# EAGLE design scratchBotV2 (EAGLE 9.6.2)
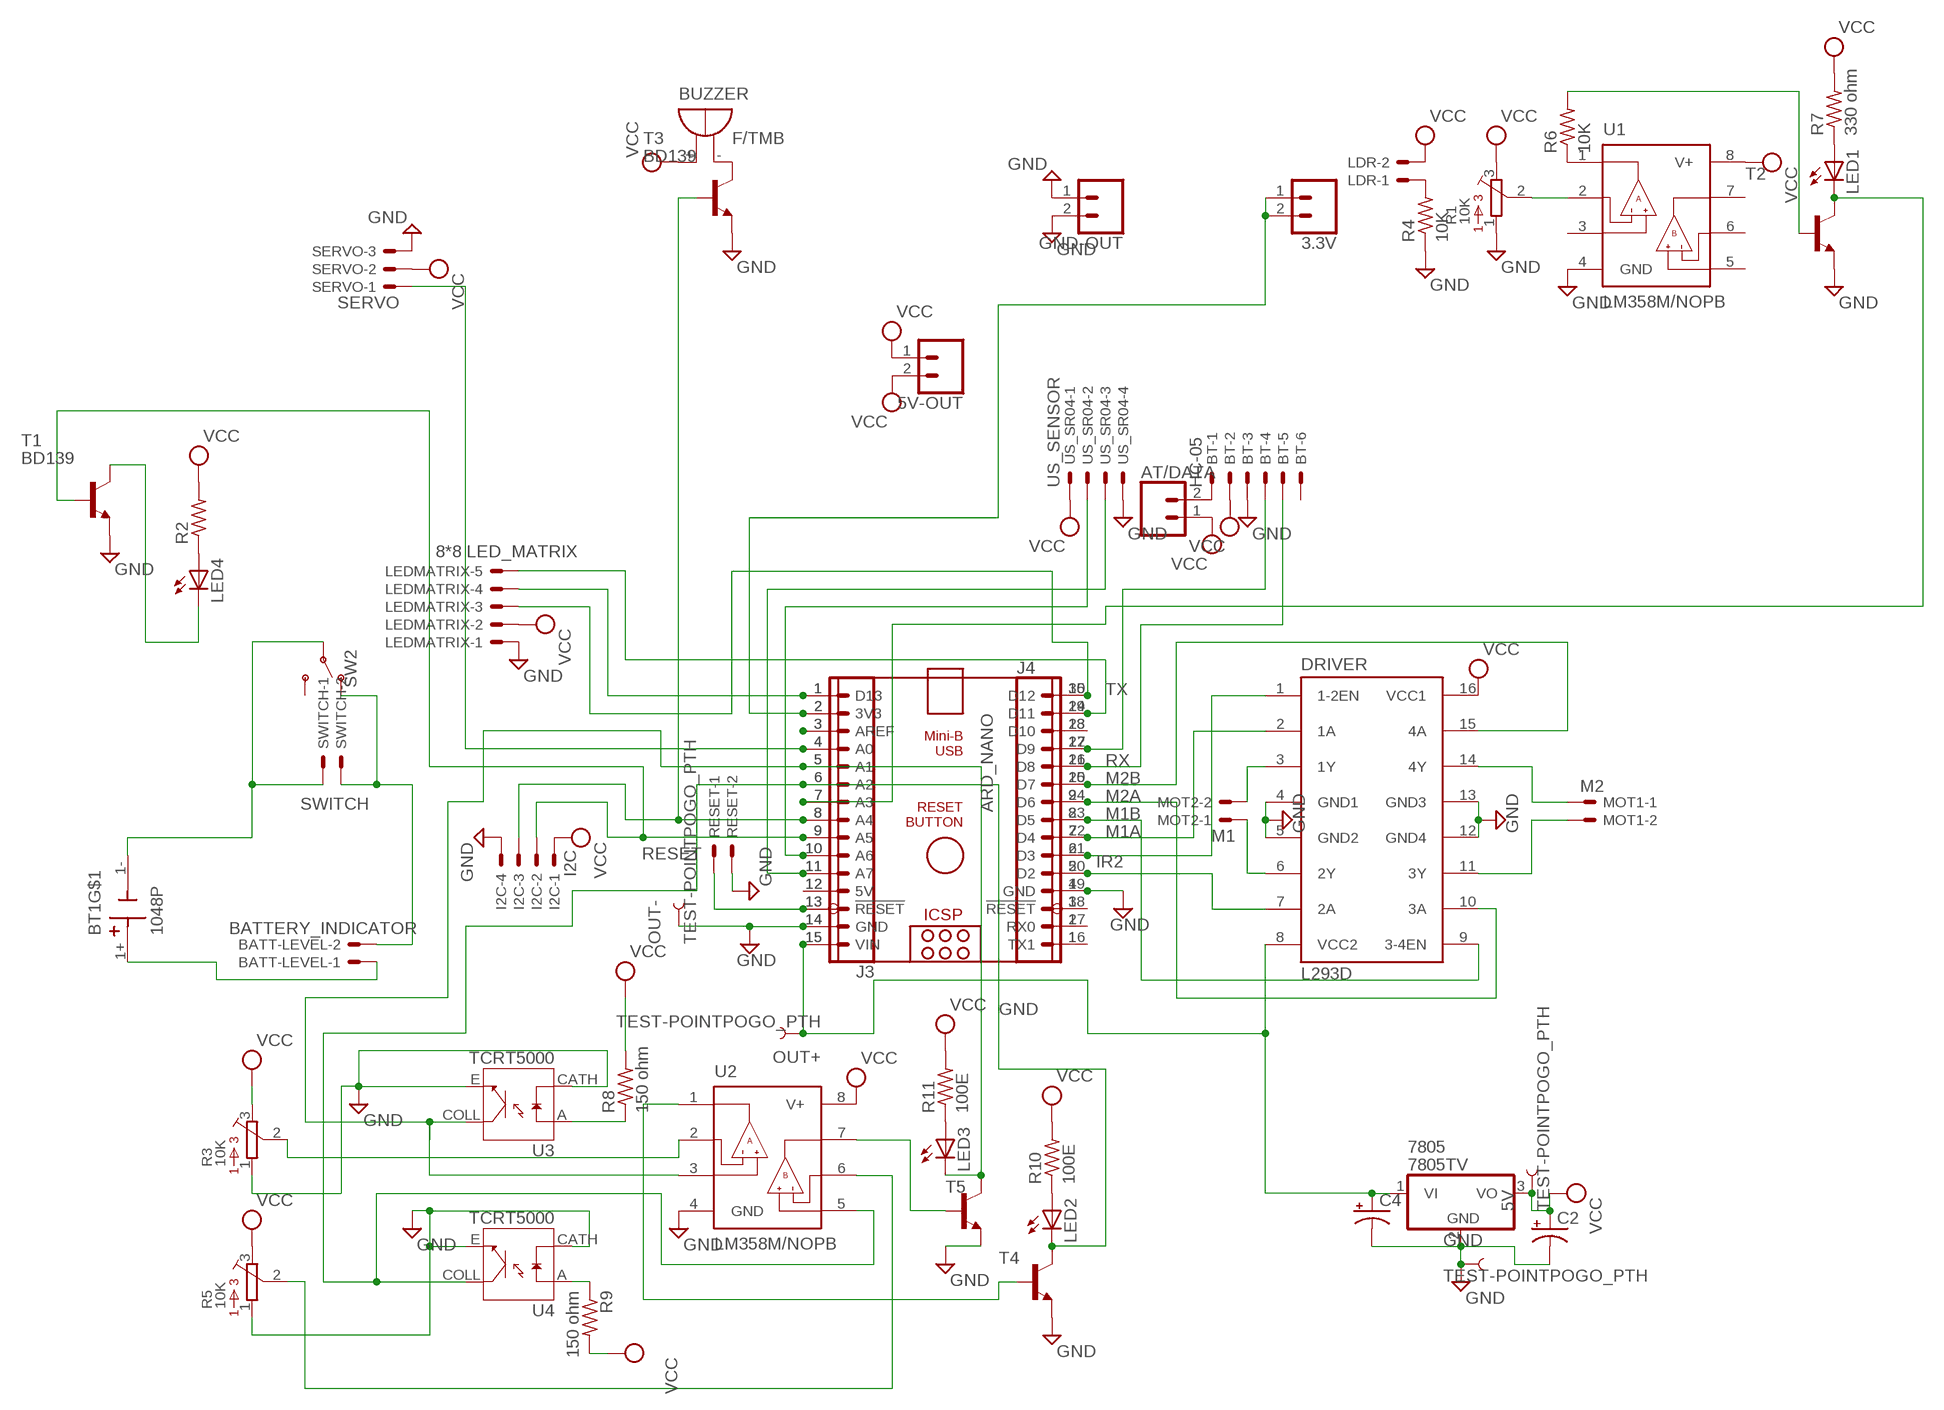
[diagram p0: schematic, sheet 1]

## Parts
3.3V  CONN_02  [1X02]
5V  TEST-POINTPOGO_PTH  [1X01_NO_SILK]
5V-OUT  CONN_02  [1X02]
7805  7805TV  [TO220V]
ARD_NANO  ARDUINO_NANO  [ARDUINO_NANO]
AT/DATA  CONN_02  [1X02]
BATT-LEVEL  BATTERY_INDICATOR  JST-XH-02-PIN-LONG-PAD  [JST-XH-02-PACKAGE-LONG-PAD]
BT  HC-05  JST-XH-06-PIN-LONG-PAD  [JST-XH-06-PACKAGE-LONG-PAD]
BT1  1048P  [BAT_1048P]
BUZZER  F/TMB  [F/TMB]
C2  CPOL-USE2.5-5  [E2,5-5]
C4  CPOL-USE2.5-5  [E2,5-5]
DRIVER  L293D  [DIL16]
GND  TEST-POINTPOGO_PTH  [1X01_NO_SILK]
GND-OUT  CONN_02  [1X02]
I2C  I2C  JST-XH-04-PIN-LONG-PAD  [JST-XH-04-PACKAGE-LONG-PAD]
J3  CONN_15  [1X15]
J4  CONN_15  [1X15]
LDR  JST-XH-02-PIN-LONG-PAD  [JST-XH-02-PACKAGE-LONG-PAD]
LED1  LEDCHIPLED_1206  [CHIPLED_1206]
LED2  LEDCHIPLED_1206  [CHIPLED_1206]
LED3  LEDCHIPLED_1206  [CHIPLED_1206]
LED4  LEDCHIPLED_1206  [CHIPLED_1206]
LEDMATRIX  8*8 LED_MATRIX  JST-XH-05-PIN-LONG-PAD  [JST-XH-05-PACKAGE-LONG-PAD]
MOT1  M2  JST-XH-02-PIN-LONG-PAD  [JST-XH-02-PACKAGE-LONG-PAD]
MOT2  M1  JST-XH-02-PIN-LONG-PAD  [JST-XH-02-PACKAGE-LONG-PAD]
OUT+  TEST-POINTPOGO_PTH  [1X01_NO_SILK]
OUT-  TEST-POINTPOGO_PTH  [1X01_NO_SILK]
R1  10K  3362H  [3362H]
R2  R-US_0204/7  [0204/7]
R3  10K  3362H  [3362H]
R4  10K  R-US_M1206  [M1206]
R5  10K  3362H  [3362H]
R6  10K  R-US_M1206  [M1206]
R7  330 ohm  R-US_M1206  [M1206]
R8  150 ohm  R-US_M1206  [M1206]
R9  150 ohm  R-US_M1206  [M1206]
R10  100E  R-US_M1206  [M1206]
R11  100E  R-US_M1206  [M1206]
RESET  RESET  JST-XH-02-PIN-LONG-PAD  [JST-XH-02-PACKAGE-LONG-PAD]
SERVO  SERVO  JST-XH-03-PIN-LONG-PAD  [JST-XH-03-PACKAGE-LONG-PAD]
SW2  SWITCH-SPDT-PTH-11.6X4.0MM  [SWITCH_SPDT_PTH_11.6X4.0MM]
SWITCH  SWITCH  JST-XH-02-PIN-LONG-PAD  [JST-XH-02-PACKAGE-LONG-PAD]
T1  BD139  [TO126]
T2  -NPN-SOT23-EBC  [SOT23-EBC]
T3  BD139  [TO126]
T4  -NPN-SOT23-EBC  [SOT23-EBC]
T5  -NPN-SOT23-EBC  [SOT23-EBC]
U1  LM358M/NOPB  [SOIC127P599X175-8N]
U2  LM358M/NOPB  [SOIC127P599X175-8N]
U3  TCRT5000  [OPTO_TCRT5000]
U4  TCRT5000  [OPTO_TCRT5000]
US_SR04  US_SENSOR  JST-XH-04-PIN-LONG-PAD  [JST-XH-04-PACKAGE-LONG-PAD]

## Nets
9V-MT3608: 7805.1(VI) ARD_NANO.15(VIN) C4.+ DRIVER.8(VCC2) J3.15 OUT+.1
ECHO: ARD_NANO.8(A4) I2C.3 J3.8 T3.3(B)
GND: 7805.2(GND) ARD_NANO.14(GND) ARD_NANO.19(GND) BT.3 C2.- C4.- DRIVER.4(GND1) DRIVER.5(GND2) DRIVER.12(GND4) DRIVER.13(GND3) GND-OUT.1 GND-OUT.2 GND.1 I2C.4 J3.14 J4.4 LEDMATRIX.1 OUT-.1 R1.1 R3.1 R4.1 R5.1 RESET.2 SERVO.3 T1.1(E) T2.E T3.1(E) T4.E T5.E U1.4(GND) U2.4(GND) U3.CATH U3.E U4.CATH U4.E US_SR04.4
IR2: ARD_NANO.21(D3) DRIVER.1(1-2EN) J4.6
M1A: ARD_NANO.22(D4) DRIVER.2(1A) J4.7
M1B: ARD_NANO.23(D5) DRIVER.9(3-4EN) J4.8
M2A: ARD_NANO.24(D6) DRIVER.10(3A) J4.9
M2B: ARD_NANO.25(D7) DRIVER.15(4A) J4.10
N$1: BT1.1- SW2.2(P) SWITCH.1
N$2: DRIVER.3(1Y) MOT2.2
N$3: R1.2 U1.2(-INA)
N$4: DRIVER.6(2Y) MOT2.1
N$5: ARD_NANO.4(A0) J3.4 SERVO.1
N$6: BATT-LEVEL.1 BT1.1+
N$8: ARD_NANO.10(A6) J3.10 US_SR04.2
N$9: DRIVER.14(4Y) MOT1.1
N$10: ARD_NANO.28(D10) J4.13
N$11: DRIVER.11(3Y) MOT1.2
N$13: ARD_NANO.27(D9) BT.4 J4.12
N$14: ARD_NANO.1(D13) J3.1 LEDMATRIX.4
N$15: ARD_NANO.7(A3) J3.7 LED1.C T2.C
N$16: ARD_NANO.5(A1) J3.5 LED3.C T5.C U2.3(+INA) U3.COLL
N$17: LED4.C T1.2(C)
N$18: BATT-LEVEL.2 SW2.1(O) SWITCH.2
N$19: ARD_NANO.13(!RESET) J3.13 RESET.1
N$20: 3.3V.1 3.3V.2 ARD_NANO.2(3V3) J3.2
N$21: ARD_NANO.11(A7) J3.11 US_SR04.3
N$22: ARD_NANO.3(AREF) J3.3
N$23: ARD_NANO.9(A5) I2C.2 J3.9 T1.3(B)
N$24: R8.1 U3.A
N$25: ARD_NANO.12(5V) J3.12
N$26: LDR.1 R4.2
N$27: R6.1 U1.1(OUTA)
N$28: R9.1 U4.A
N$29: BUZZER.- T3.2(C)
N$31: R6.2 T2.B
N$32: ARD_NANO.6(A2) J3.6 LED2.C T4.C U2.5(+INB) U4.COLL
N$33: ARD_NANO.29(D11) J4.14 LEDMATRIX.5
N$34: ARD_NANO.16(TX1) J4.1
N$35: ARD_NANO.17(RX0) J4.2
N$36: ARD_NANO.18(!RESET) J4.3
N$37: AT/DATA.2 BT.1
N$38: LED1.A R7.1
N$39: ARD_NANO.20(D2) DRIVER.7(2A) J4.5
N$42: R3.2 U2.2(-INA)
N$43: LED3.A R11.1
N$44: LED2.A R10.1
N$45: T4.B U2.1(OUTA)
N$47: T5.B U2.7(OUTB)
N$48: R5.2 U2.6(-INB)
N$49: LED4.A R2.1
RX: ARD_NANO.26(D8) BT.5 J4.11
TX: ARD_NANO.30(D12) J4.15 LEDMATRIX.3
VCC: 5V-OUT.1 5V-OUT.2 5V.1 7805.3(VO) AT/DATA.1 BT.2 BUZZER.+ C2.+ DRIVER.16(VCC1) I2C.1 LDR.2 LEDMATRIX.2 R1.3 R2.2 R3.3 R5.3 R7.2 R8.2 R9.2 R10.2 R11.2 SERVO.2 U1.8(V+) U2.8(V+) US_SR04.1
Unconnected: BT1.2+ BT1.2- BT.6 SW2.3(S) U1.3(+INA) U1.5(+INB) U1.6(-INB) U1.7(OUTB)

## Library data of the parts
3.3V 5V-OUT AT/DATA GND-OUT = SparkFun-Connectors:CONN_02: Multi connection point. Often used as Generic Header-pin footprint for 0.1 inch spaced/style header connections On any of the 0.1 inch spaced packages, you can populate with these: Break Away Headers - Straight <https://www.sparkfun.com/products/116> (PRT-00116) Break Away Male Headers - Right Angle <https://www.sparkfun.com/products/553> (PRT-00553) Female Headers <https://www.sparkfun.com/products/115> (PRT-00115) Break Away Headers - Machine Pin <https://www.sparkfun.com/products/117> (PRT-00117) Break Away Female Headers - Swiss Machine Pin <https://www.sparkfun.com/products/743> (PRT-00743) For SCREWTERMINALS and SPRING TERMINALS visit here: Screw Terimnals on SparkFun.com <https://www.sparkfun.com/search/results?term=Screw+Terminals> (5mm/3.5mm/2.54mm spacing) This device is also useful as a general connection point to wire up your design to another part of your project. Our various solder wires solder well into these plated through hole pads. Hook-Up Wire - Assortment (Stranded, 22 AWG) <https://www.sparkfun.com/products/11375> (PRT-11375) Hook-Up Wire - Assortment (Solid Core, 22 AWG) <https://www.sparkfun.com/products/11367> (PRT-11367) View the entire wire category on our website here <https://www.sparkfun.com/categories/141> Special notes: Molex polarized connector foot print use with: PRT-08233 with associated crimp pins and housings. 2.54_SCREWTERM for use with PRT-10571. 3.5mm Screw Terminal footprints for PRT-08084 5mm Screw Terminal footprints for use with PRT-08432
5V GND OUT+ OUT- = SparkFun-Connectors:TEST-POINT: SparkFun Test Points Bare copper test points for troubleshooting or In-Circuit-Testing. These are used by our Production team for verifying production board runs using pogo-pins on test beds. SparkFun Products: SparkFun LSM9DS1 Breakout <https://www.sparkfun.com/products/13284> SparkFun PSOC <https://www.sparkfun.com/products/13714> SparkFun Load Cell Amplifier <https://www.sparkfun.com/products/13879>
7805 = linear:78*: Positive VOLTAGE REGULATOR Source: http://cache.national.com/ds/LM/LM78L05.pdf http://www.fairchildsemi.com/ds/LM/LM7805.pdf
ARD_NANO = ArduinoNanoV30:ARDUINO_NANO: Arduino Nano V3.0 Overview: The Arduino Nano is a small, complete, and breadboard-friendly board based on the ATmega328 (Arduino Nano 3.x) or ATmega168 (Arduino Nano 2.x). It has more or less the same functionality of the Arduino Duemilanove, but in a different package. It lacks only a DC power jack, and works with a Mini-B USB cable instead of a standard one. The Nano was designed and is being produced by Gravitech. Specifications: Microcontroller Atmel ATmega168 or ATmega328 Operating Voltage (logic level) 5 V Input Voltage (recommended) 7-12 V Input Voltage (limits) 6-20 V Digital I/O Pins 14 (of which 6 provide PWM output) Analog Input Pins 8 DC Current per I/O Pin 40 mA Flash Memory 16 KB (ATmega168) or 32 KB (ATmega328) of which 2 KB used by bootloader SRAM 1 KB (ATmega168) or 2 KB (ATmega328) EEPROM 512 bytes (ATmega168) or 1 KB (ATmega328) Clock Speed 16 MHz Dimensions 0.73" x 1.70" Length 45 mm Width 18 mm Weigth 5 g Power: The Arduino Nano can be powered via the Mini-B USB connection, 6-20V unregulated external power supply (pin 30), or 5V regulated external power supply (pin 27). The power source is automatically selected to the highest voltage source. Memory: The ATmega168 has 16 KB of flash memory for storing code (of which 2 KB is used for the bootloader); the ATmega328 has 32 KB, (also with 2 KB used for the bootloader). The ATmega168 has 1 KB of SRAM and 512 bytes of EEPROM (which can be read and written with the EEPROM library); the ATmega328 has 2 KB of SRAM and 1 KB of EEPROM. Input and Output: Each of the 14 digital pins on the Nano can be used as an input or output, using pinMode(), digitalWrite(), and digitalRead() functions. They operate at 5 volts. Each pin can provide or receive a maximum of 40 mA and has an internal pull-up resistor (disconnected by default) of 20-50 kOhms. In addition, some pins have specialized functions. Visit Arduino - ArduinoBoardNano <https://www.arduino.cc/en/Main/ArduinoBoardNano>
BATT-LEVEL MOT1 MOT2 RESET SWITCH = Rembrandt Electronics - JST XH Connectors v1-0 (1):JST-XH-02-PIN: JST XH Connector 2 Pin Wire to board connector. Pitch: 2,54 mm, (0.100") Number of pins: 2 Created by Rembrandt Electronics www.rembrandtelectronics.com
BT = Rembrandt Electronics - JST XH Connectors v1-0 (1):JST-XH-06-PIN: JST XH Connector 2 Pin Wire to board connector. Pitch: 2,54 mm, (0.100") Number of pins: 6 Created by Rembrandt Electronics www.rembrandtelectronics.com
BT1 = 1048P:1048P: Battery Holder (Open) 18650 2 Cell SMD (SMT) Tab Check prices <https://pricing.snapeda.com/parts/1048P/Keystone%20Electronics/view-part?ref=eda>; AVAILABILITY: In Stock; DESCRIPTION: SMT Polarized Holder for Dual 18650 Batteries; MF: Keystone Electronics; MP: 1048P; PACKAGE: None; PRICE: None; PURCHASE-URL: https://pricing.snapeda.com/search/part/1048P/?ref=eda
BUZZER = buzzer:F/TMB: BUZZER Source: Buerklin; OC_FARNELL: unknown; OC_NEWARK: unknown
C2 C4 = adafruit:CPOL-US: POLARIZED CAPACITOR, American symbol
DRIVER = st-microelectronics:L293D: PUSH-PULL 4 CHANNEL DRIVER; MPN: L293D; OC_FARNELL: 9589619; OC_NEWARK: 56P8249
I2C US_SR04 = Rembrandt Electronics - JST XH Connectors v1-0 (1):JST-XH-04-PIN: JST XH Connector 2 Pin Wire to board connector. Pitch: 2,54 mm, (0.100") Number of pins: 4 Created by Rembrandt Electronics www.rembrandtelectronics.com
J3 J4 = SparkFun-Connectors:CONN_15: Multi connection point. Often used as Generic Header-pin footprint for 0.1 inch spaced/style header connections On any of the 0.1 inch spaced packages, you can populate with these: Break Away Headers - Straight <https://www.sparkfun.com/products/116> (PRT-00116) Break Away Male Headers - Right Angle <https://www.sparkfun.com/products/553> (PRT-00553) Female Headers <https://www.sparkfun.com/products/115> (PRT-00115) Break Away Headers - Machine Pin <https://www.sparkfun.com/products/117> (PRT-00117) Break Away Female Headers - Swiss Machine Pin <https://www.sparkfun.com/products/743> (PRT-00743) For SCREWTERMINALS and SPRING TERMINALS visit here: Screw Terimnals on SparkFun.com <https://www.sparkfun.com/search/results?term=Screw+Terminals> (5mm/3.5mm/2.54mm spacing) This device is also useful as a general connection point to wire up your design to another part of your project. Our various solder wires solder well into these plated through hole pads. Hook-Up Wire - Assortment (Stranded, 22 AWG) <https://www.sparkfun.com/products/11375> (PRT-11375) Hook-Up Wire - Assortment (Solid Core, 22 AWG) <https://www.sparkfun.com/products/11367> (PRT-11367) View the entire wire category on our website here <https://www.sparkfun.com/categories/141> Special notes: Molex polarized connector foot print use with SKU : PRT-08231 with associated crimp pins and housings. 1MM SMD Version SKU: PRT-10208 NOTES ON THE VARIANTS LOCK and LOCK_LONGPADS... This footprint was designed to help hold the alignment of a through-hole component (i.e. 6-pin header) while soldering it into place. You may notice that each hole has been shifted either up or down by 0.005 of an inch from it's more standard position (which is a perfectly straight line). This slight alteration caused the pins (the squares in the middle) to touch the edges of the holes. Because they are alternating, it causes a "brace" to hold the component in place. 0.005 has proven to be the perfect amount of "off-center" position when using our standard breakaway headers. Although looks a little odd when you look at the bare footprint, once you have a header in there, the alteration is very hard to notice. Also,if you push a header all the way into place, it is covered up entirely on the bottom side.
LDR = Rembrandt Electronics - JST XH Connectors v1-0:JST-XH-02-PIN: JST XH Connector 2 Pin Wire to board connector. Pitch: 2,54 mm, (0.100") Number of pins: 2 Created by Rembrandt Electronics www.rembrandtelectronics.com
LED1-LED4 = adafruit:LED: LED OSRAM: - CHIPLED LG R971, LG N971, LY N971, LG Q971, LY Q971, LO R971, LY R971 LH N974, LH R974 LS Q976, LO Q976, LY Q976 LO Q996 - Hyper CHIPLED LW Q18S LB Q993, LB Q99A, LB R99A - SideLED LS A670, LO A670, LY A670, LG A670, LP A670 LB A673, LV A673, LT A673, LW A673 LH A674 LY A675 LS A676, LA A676, LO A676, LY A676, LW A676 LS A679, LY A679, LG A679 - Hyper Micro SIDELED® LS Y876, LA Y876, LO Y876, LY Y876 LT Y87S - SmartLED LW L88C, LW L88S LB L89C, LB L89S, LG L890 LS L89K, LO L89K, LY L89K LS L896, LA L896, LO L896, LY L896 - TOPLED LS T670, LO T670, LY T670, LG T670, LP T670 LSG T670, LSP T670, LSY T670, LOP T670, LYG T670 LG T671, LOG T671, LSG T671 LB T673, LV T673, LT T673, LW T673 LH T674 LS T676, LA T676, LO T676, LY T676, LB T676, LH T676, LSB T676, LW T676 LB T67C, LV T67C, LT T67C, LS T67K, LO T67K, LY T67K, LW E67C LS E67B, LA E67B, LO E67B, LY E67B, LB E67C, LV E67C, LT E67C LW T67C LS T679, LY T679, LG T679 LS T770, LO T770, LY T770, LG T770, LP T770 LB T773, LV T773, LT T773, LW T773 LH T774 LS E675, LA E675, LY E675, LS T675 LS T776, LA T776, LO T776, LY T776, LB T776 LHGB T686 LT T68C, LB T68C - Hyper Mini TOPLED® LB M676 - Mini TOPLED Santana® LG M470 LS M47K, LO M47K, LY M47K Source: http://www.osram.convergy.de/
LEDMATRIX = Rembrandt Electronics - JST XH Connectors v1-0 (1):JST-XH-05-PIN: JST XH Connector 2 Pin Wire to board connector. Pitch: 2,54 mm, (0.100") Number of pins: 5 Created by Rembrandt Electronics www.rembrandtelectronics.com
R1 R3 R5 = bourns:3362: 3362 Series 1/4" Square Trimmer
R2 R4 R6-R11 = adafruit:R-US_: RESISTOR, American symbol
SERVO = Rembrandt Electronics - JST XH Connectors v1-0 (1):JST-XH-03-PIN: JST XH Connector 2 Pin Wire to board connector. Pitch: 2,54 mm, (0.100") Number of pins: 3 Created by Rembrandt Electronics www.rembrandtelectronics.com
SW2 = SparkFun-Switches:SWITCH-SPDT: Single Pole, Double Throw (SPDT) Switch Single-pole, double-throw (SPDT) switch. Variant Overview SMD-AYZ0202 Surface Mount DPDT Switch <https://www.sparkfun.com/products/597> (COM-00597) Used on e.g. LilyPad Arduino USB - ATmega32U4 Board <https://www.sparkfun.com/products/12049> PTH-11.6X4.0MM SPDT Mini Power Switch <https://www.sparkfun.com/products/102> (COM-00102) Used on e.g. SparkFun Simon Says - Through-Hole Soldering Kit <https://www.sparkfun.com/products/10547> (KIT-10547) PTH-11.6X4.0MM-KIT KIT version of SPDT Mini Power Switch - Simplifies soldering by removing tStop of switch pins - only one side can be soldered. PTH-11.6X4.0MM-LOCK LOCK version of SPDT Mini Power Switch - Offset pins hold switch in place for easier soldering. SMD-RIGHT-ANGLE Surface Mount Right Angle Switch <https://www.sparkfun.com/products/10860> (COM-10860) Used on e.g. SparkFun ESP8266 Thing <https://www.sparkfun.com/products/13231>; PROD_ID: SWCH-08261; SF_SKU: COM-00102
T1 T3 = transistor:BD139: NPN TRANSISTOR
T2 T4 T5 = transistor:*-NPN-: NPN Transistror BF959 corrected 2008.03.06
U1 U2 = LM358M_NOPB:LM358M/NOPB: Check prices <https://snapeda.com/parts/LM358M/NOPB/NOPB/Texas%20Instruments/view-part/?ref=eda> Check prices <https://pricing.snapeda.com/parts/LM358M/NOPB/Texas%20Instruments/view-part?ref=eda>; AVAILABILITY: In Stock; DESCRIPTION: 2-Channel, 1MHz, industry standard, 32V op amp 8-SOIC 0 to 70; MF: Texas Instruments; MP: LM358M/NOPB; PACKAGE: SOIC-8 Texas Instruments; PRICE: None; PURCHASE-URL: https://pricing.snapeda.com/search/part/LM358M/NOPB/?ref=eda
U3 U4 = TCRT5000:TCRT5000: 950 nm 60 mA Through Hole Reflective Optical Sensor with Transistor Output Check prices <https://pricing.snapeda.com/parts/TCRT5000/Vishay/view-part?ref=eda>; AVAILABILITY: In Stock; DESCRIPTION: Reflective Optical Sensor 0.591 (15mm) PCB Mount; MF: Vishay; MP: TCRT5000; PACKAGE: TCRT5000 Vishay; PRICE: None; PURCHASE-URL: https://pricing.snapeda.com/search/part/TCRT5000/?ref=eda

## Board
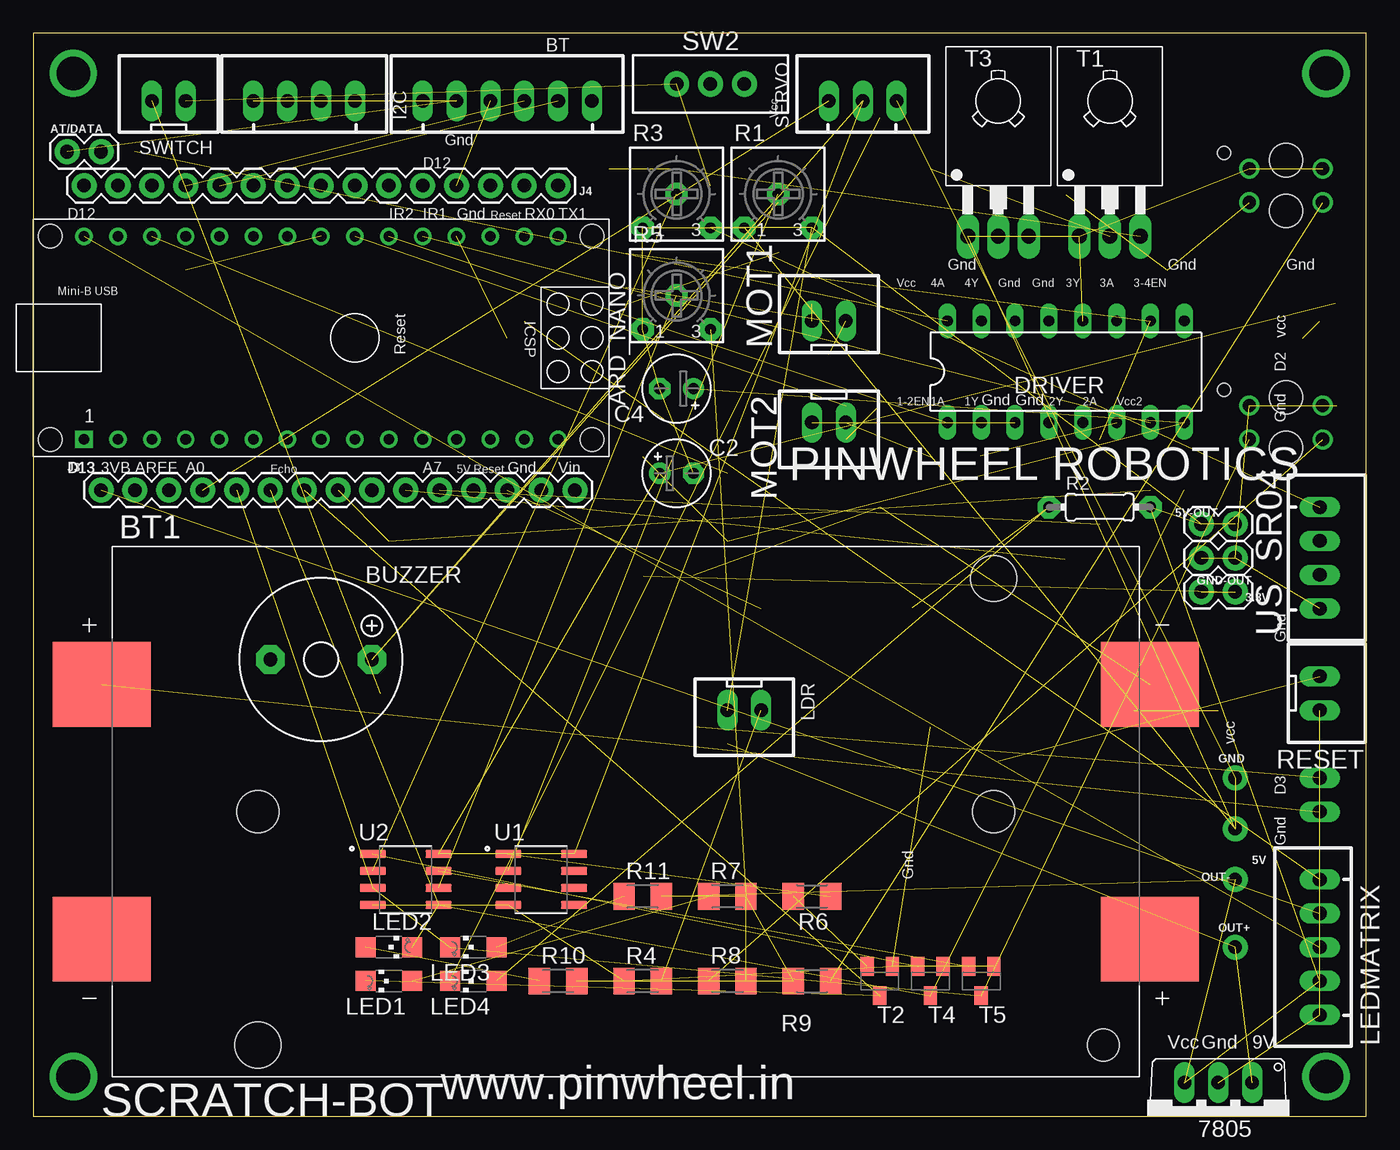
[diagram p1: board, top side]
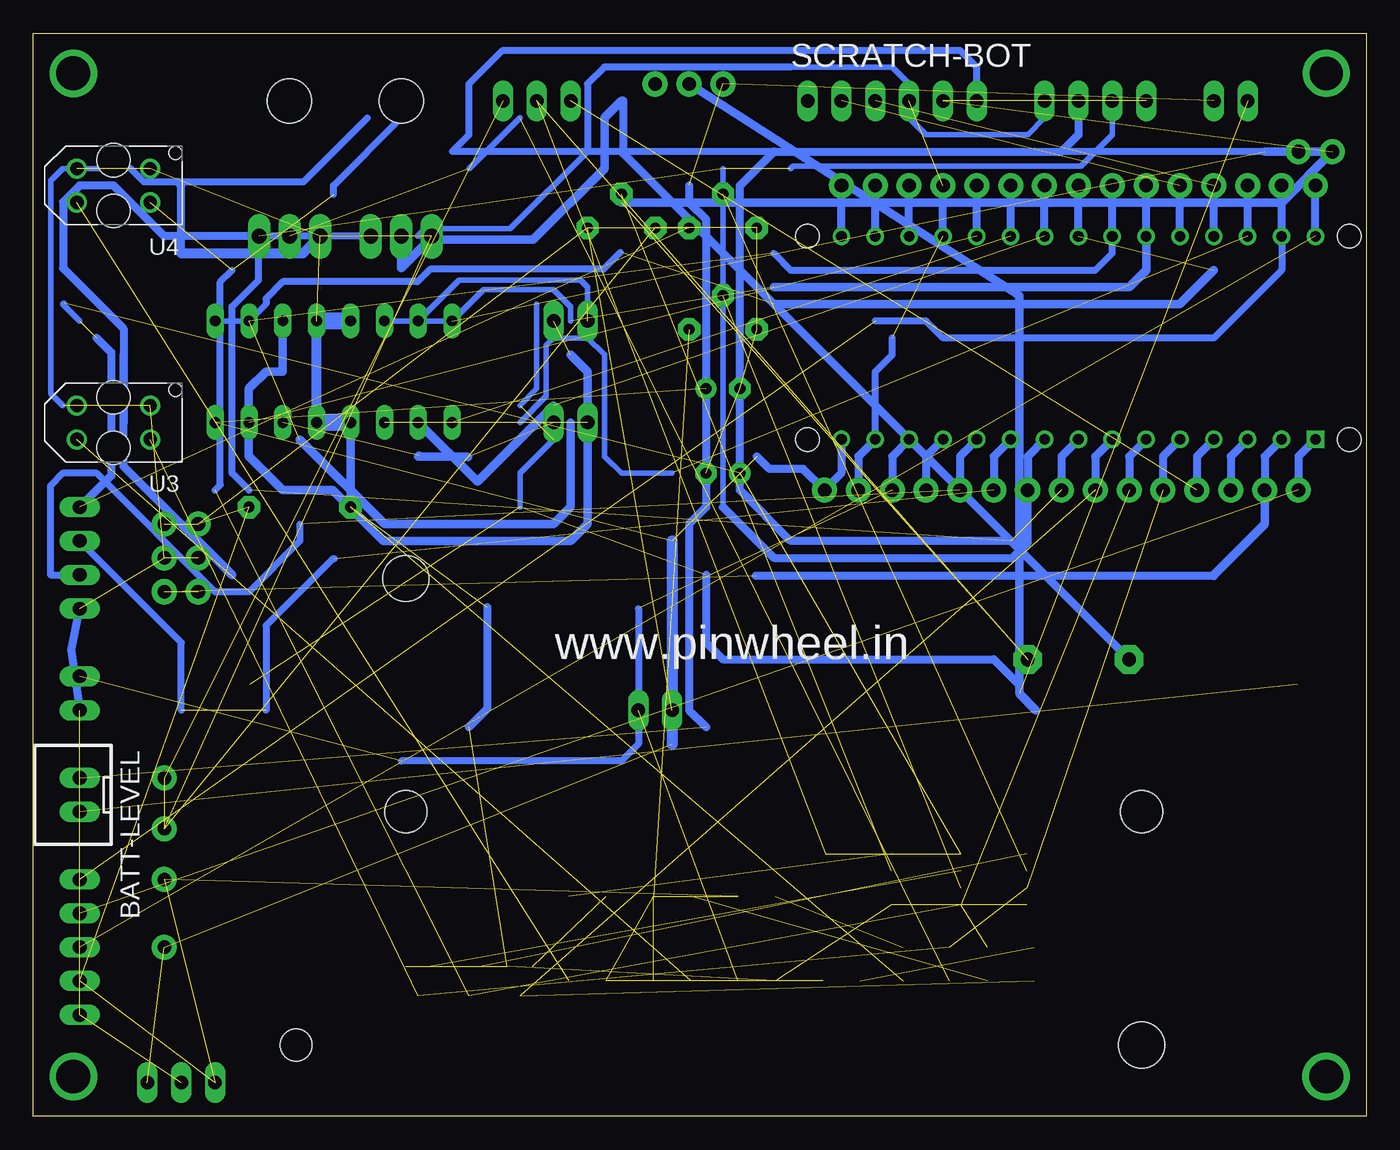
[diagram p2: board, bottom side, seen from below]

Size 100 x 81.27 mm. Coordinates in mm from the lower left corner, seen from the top.
Outline: 0,0 100,0 100,81.27 0,81.27 0,0
Copper layers (1*16): Top 0.035mm / dielectric 1.5mm / Bottom 0.035mm
Design rules "default *": minimum track width 6mil, minimum drill 0.35mm, track to track 12mil, track to pad 12mil, pad to pad 12mil, via to via 12mil, smd to smd 12mil, copper to edge 40mil, drill to drill 6mil, minimum pad ring 10mil, minimum via ring 8mil, stop-mask expansion 4mil, vias tented up to drill 0mil, thermal gap 10mil

### Footprints (pad centres in the part's own frame; a part is rotated, then mirrored left to right if it is on the bottom)
1X02 = drill 1.016 pad 1.88: 1 0,0; 2 2.54,0
1X01_NO_SILK = drill 1.016 pad 1.88: 1 0,0
TO220V = drill 1.016 long: 1 -2.54,-2.54; 2 0,-2.54; 3 2.54,-2.54
ARDUINO_NANO = drill 0.8 square: 1 -20.32,-7.62 | drill 0.8: 2 -17.78,-7.62; 3 -15.24,-7.62; 4 -12.7,-7.62; 5 -10.16,-7.62; 6 -7.62,-7.62; 7 -5.08,-7.62; 8 -2.54,-7.62; 9 0,-7.62; 10 2.54,-7.62; 11 5.08,-7.62; 12 7.62,-7.62; 13 10.16,-7.62; 14 12.7,-7.62; 15 15.24,-7.62; 16 15.24,7.62; 17 12.7,7.62; 18 10.16,7.62; 19 7.62,7.62; 20 5.08,7.62; 21 2.54,7.62; 22 0,7.62; 23 -2.54,7.62; 24 -5.08,7.62; 25 -7.62,7.62; 26 -10.16,7.62; 27 -12.7,7.62; 28 -15.24,7.62; 29 -17.78,7.62; 30 -20.32,7.62 | hole 1.778: -22.86,-7.62; -22.86,7.62; 17.78,7.62; 17.78,-7.62
JST-XH-02-PACKAGE-LONG-PAD = drill 1.016 long: 1 -1.27,0; 2 1.27,0
JST-XH-06-PACKAGE-LONG-PAD = drill 1.016 long: 1 -6.35,0; 2 -3.81,0; 3 -1.27,0; 4 1.27,0; 5 3.81,0; 6 6.35,0
BAT_1048P = smd 7.34 x 6.35: 1+ -39.33,9.555; 1- 39.33,9.555; 2+ 39.33,-9.555; 2- -39.33,-9.555 | hole 3.17: -27.6,0; 27.6,0 | hole 3.45: -27.6,-17.505; 27.6,17.505 | hole 2.39: 35.82,-17.505
F/TMB = drill 1.016 pad 2.159 octagon: + 3.81,0; - -3.81,0
E2,5-5 = drill 0.813 pad 1.6: + -1.27,0 | drill 0.813 pad 1.6 octagon: - 1.27,0
DIL16 = drill 0.813 long: 1 -8.89,-3.81; 2 -6.35,-3.81; 3 -3.81,-3.81; 4 -1.27,-3.81; 5 1.27,-3.81; 6 3.81,-3.81; 7 6.35,-3.81; 8 8.89,-3.81; 9 8.89,3.81; 10 6.35,3.81; 11 3.81,3.81; 12 1.27,3.81; 13 -1.27,3.81; 14 -3.81,3.81; 15 -6.35,3.81; 16 -8.89,3.81
JST-XH-04-PACKAGE-LONG-PAD = drill 1.016 long: 1 -3.81,0; 2 -1.27,0; 3 1.27,0; 4 3.81,0
1X15 = drill 1.016 pad 1.88: 1 0,0; 2 2.54,0; 3 5.08,0; 4 7.62,0; 5 10.16,0; 6 12.7,0; 7 15.24,0; 8 17.78,0; 9 20.32,0; 10 22.86,0; 11 25.4,0; 12 27.94,0; 13 30.48,0; 14 33.02,0; 15 35.56,0
CHIPLED_1206 = smd 1.5 x 1.5: A 0,-1.75; C 0,1.75
JST-XH-05-PACKAGE-LONG-PAD = drill 1.016 long: 1 -5.08,0; 2 -2.54,0; 3 0,0; 4 2.54,0; 5 5.08,0
3362H = drill 0.813 pad 1.676 octagon: 1 -2.54,-3.175; 2 0,-0.635; 3 2.54,-3.175
0204/7 = drill 0.813 pad 1.676 octagon: 1 -3.81,0; 2 3.81,0
M1206 = smd 1.6 x 2: 1 -1.4,0; 2 1.4,0
JST-XH-03-PACKAGE-LONG-PAD = drill 1.016 long: 1 -2.54,0; 2 0,0; 3 2.54,0
SWITCH_SPDT_PTH_11.6X4.0MM = drill 1.016 pad 1.88: 1 0,2.54; 2 0,0; 3 0,-2.54
TO126 = drill 1.118 long: 1 -2.286,-5.08; 2 0,-5.08; 3 2.286,-5.08 | hole 3.302: 0,5.08
SOT23-EBC = smd 1 x 1.4: B 0.95,-1.1; C 0,1.1; E -0.95,-1.1
SOIC127P599X175-8N = smd 1.97 x 0.6: 1 -2.47,1.905; 2 -2.47,0.635; 3 -2.47,-0.635; 4 -2.47,-1.905; 5 2.47,-1.905; 6 2.47,-0.635; 7 2.47,0.635; 8 2.47,1.905
OPTO_TCRT5000 = drill 1 pad 1.5: A 2.75,1.27; CATH 2.75,-1.27; COLL -2.75,1.27; E -2.75,-1.27 | hole 1: -4.65,-2.45 | hole 2.5: 0,-1.9; 0,1.9

### Placement (x,y rotation side)
3.3V  90.17,39.37 180 top
5V  90.17,17.78 0 top
5V-OUT  90.17,44.45 180 top
7805  88.9,0 180 top
ARD_NANO  24.13,58.42 0 top
AT/DATA  2.54,72.39 0 top
BATT-LEVEL  96.52,24.13 90 bottom
BT  35.56,76.2 0 top
BT1  44.45,22.86 0 top
BUZZER  21.59,34.29 0 top
C2  48.26,48.26 0 top
C4  48.26,54.61 180 top
DRIVER  77.47,55.88 0 top
GND  90.17,25.4 0 top
GND-OUT  90.17,41.91 180 top
I2C  20.32,76.2 0 top
J3  5.08,46.99 0 top
J4  39.37,69.85 180 top
LDR  53.34,30.48 180 top
LED1  26.67,10.16 90 top
LED2  26.67,12.7 270 top
LED3  33.02,12.7 90 top
LED4  33.02,10.16 90 top
LEDMATRIX  96.52,12.7 90 top
MOT1  59.69,59.69 0 top
MOT2  59.69,52.07 180 top
OUT+  90.17,12.7 0 top
OUT-  90.17,21.59 0 top
R1  55.88,69.85 0 top
R2  80.01,45.72 0 top
R3  48.26,69.85 0 top
R4  45.72,10.16 0 top
R5  48.26,62.23 0 top
R6  58.42,16.51 180 top
R7  52.07,16.51 0 top
R8  52.07,10.16 0 top
R9  58.42,10.16 180 top
R10  39.37,10.16 0 top
R11  45.72,16.51 0 top
RESET  96.52,31.75 270 top
SERVO  62.23,76.2 0 top
SW2  50.8,77.47 90 top
SWITCH  10.16,76.2 0 top
T1  80.78,71.12 0 top
T2  63.5,10.16 180 top
T3  72.39,71.12 0 top
T4  67.31,10.16 180 top
T5  71.12,10.16 180 top
U1  38.1,17.78 0 top
U2  27.94,17.78 0 top
U3  93.98,52.07 180 bottom
U4  93.98,69.85 180 bottom
US_SR04  96.52,41.91 270 top

### Tracks (layer width: path | path; a pad name or v marks a point on that pad's centre or on a via)
9V-MT3608  (5 unrouted)
  Bottom 0.61: ARD_NANO.15 39.37,48.26 J3.15 42.24,48.59 44.78,48.59 45.72,49.53
  Bottom 0.813: 52.07,43.18 52.07,27.94
ECHO  (2 unrouted)
  Bottom 0.508: T3.3 83.13,66.04 83.13,62.73 85.09,60.77 85.09,48.26 83.82,46.99
  Bottom 0.61: ARD_NANO.8 22.86,49.53 J3.8 | 26.67,43.18 43.18,43.18 46.99,46.99 46.99,69.85 44.45,72.39 22.86,72.39 21.59,73.66 I2C.3
GND  (28 unrouted)
  Bottom 0.406: 97.79,53.34 98.68,54.23 98.68,70.23 97.79,71.12 92.71,71.12 | I2C.4 24.13,74.93 25.4,73.66 33.02,73.66 34.29,74.93 BT.3 34.29,77.47 35.56,78.74 43.18,78.74 | 58.42,72.39 64.21,66.6 70.61,66.6 71.16,66.04 T3.1
  Bottom 0.508: ARD_NANO.14 36.83,55.88 35.56,57.15 35.56,58.42 | 92.71,71.12 91.69,70.1 89.15,70.1 79.76,70.1 74.93,74.93 | 43.18,78.74 57.15,78.74 58.42,77.47 58.42,72.39
  Bottom 0.61: RESET.2 97.16,34.93 US_SR04.4 | 89.15,70.1 88.9,69.85 88.9,64.77 | 65.94,38.2 65.94,30.58 67.31,29.21 | ARD_NANO.19 J4.4 | ARD_NANO.14 38.1,49.53 J3.14
  Bottom 0.635: 76.2,45.72 DRIVER.4
  Bottom 0.762: DRIVER.5 DRIVER.12 | 88.9,64.77 79.76,64.77 T1.1
  Bottom 1.27: DRIVER.13 DRIVER.12 | DRIVER.4 DRIVER.5
IR2  (1 unrouted)
  Bottom 0.61: ARD_NANO.21 J4.6
M1A  (1 unrouted)
  Bottom 0.61: ARD_NANO.22 J4.7
  Bottom 0.635: 60.96,53.34 66.67,47.62 DRIVER.2
M1B  (3 unrouted)
  Bottom 0.406: DRIVER.9 83.82,59.69 82.55,60.96
  Bottom 0.508: 55.95,64.84 57.22,63.57 70.22,63.57 71.17,62.62 81.28,62.62 82.55,61.35 82.55,60.96
  Bottom 0.61: ARD_NANO.23 J4.8
  Bottom 0.635: 80.01,50.8 73.66,44.45 60.96,44.45 59.69,45.72 59.69,52.07 | 11.43,63.5 13.97,60.96 44.45,60.96
M2A  (1 unrouted)
  Bottom 0.508: 44.45,64.77 43.18,63.5 20.32,63.5 19.05,64.77 ARD_NANO.24
  Bottom 0.61: ARD_NANO.24 J4.9
M2B  (1 unrouted)
  Bottom 0.406: DRIVER.15 68.58,59.69 66.23,62.04 60.96,62.04 59.69,60.77 59.69,59.69
  Bottom 0.61: ARD_NANO.25 J4.10
  Bottom 0.635: ARD_NANO.25 16.51,63.5 17.78,62.23 44.45,62.23
N$1  (4 unrouted)
  Bottom 0.406: 63.5,45.72 63.5,48.26 60.96,50.8 | 63.49,53.35 62.23,54.61 62.23,60.96
  Bottom 0.61: 26.04,31.75 26.04,32.38 27.94,34.29 48.26,34.29 49.53,35.56 49.53,40.64
  Bottom 0.635: SW2.2 26.04,61.6 26.04,31.75 24.77,30.48
N$2  (1 unrouted)
N$3  (1 unrouted)
N$4  (2 unrouted)
  Bottom 0.635: 67.38,49.46 67.45,49.53 71.12,49.53 71.06,49.59
N$5  (1 unrouted)
  Bottom 0.61: ARD_NANO.4 12.7,49.53 J3.4
N$6  (1 unrouted)
N$7  (via drill 2.5)
  other vias: 3,78.27
N$8  (2 unrouted)
  Bottom 0.508: 77.4,41.84 77.54,41.84 82.55,36.83 82.55,30.48 | 88.9,30.48 88.9,35.56 US_SR04.2
  Bottom 0.61: ARD_NANO.10 27.94,49.53 J3.10
N$9  (1 unrouted)
  Bottom 0.406: 58.42,60.96 58.42,62.23 58.94,62.75 68.06,62.75 71.12,59.69 DRIVER.14
N$10  (1 unrouted)
  Bottom 0.406: 52.07,48.26 55.88,48.26 57.15,49.53 57.15,57.15 58.42,58.42 60.96,58.42 61.52,57.86 61.52,54.05 63.5,52.07
  Bottom 0.61: ARD_NANO.28 J4.13
N$11  (1 unrouted)
  Bottom 0.635: DRIVER.11 81.28,55.88 82.55,55.88 83.83,54.6 83.83,49.54 81.28,46.99 77.53,46.99 73.72,43.18 59.69,43.18 58.42,44.45 58.42,55.88 59.69,57.15
N$12  (via drill 2.54)
  other vias: 3,3 97,3 97,78.27
N$13  (1 unrouted)
  Bottom 0.61: ARD_NANO.27 J4.12
N$14  (1 unrouted)
  Bottom 0.61: ARD_NANO.1 5.08,49.53 J3.1
N$15  (2 unrouted)
  Bottom 0.61: ARD_NANO.7 20.32,49.53 J3.7
N$16  (4 unrouted)
  Bottom 0.61: J3.5 15.24,49.53 ARD_NANO.5
N$17  (2 unrouted)
  Bottom 0.406: 67.31,71.12 63.5,74.93
N$18  (3 unrouted)
  Bottom 0.61: 50.8,69.85 50.8,68.58 49.53,67.31 49.53,45.72 50.8,44.45 50.8,30.48 49.53,29.21
N$19  (2 unrouted)
  Bottom 0.508: 54.61,38.1 54.61,27.94 55.88,26.67 72.39,26.67
  Bottom 0.61: J3.13 35.56,49.53 ARD_NANO.13
N$20  (2 unrouted)
  Bottom 0.61: ARD_NANO.2 7.62,49.53 J3.2 | 11.43,40.57 45.79,40.57
  Bottom 0.635: J3.2 7.62,44.45 11.43,40.64 11.43,40.57
N$21  (1 unrouted)
  Bottom 0.508: 80.01,44.45 80.01,43.18 83.82,39.37 86.36,39.37 95.25,48.26 97.79,48.26 98.73,47.32 98.73,40.64 US_SR04.3
  Bottom 0.61: J3.11 30.48,49.53 ARD_NANO.11
N$22
  Bottom 0.61: ARD_NANO.3 10.16,49.53 J3.3
N$23  (2 unrouted)
  Bottom 0.406: I2C.2 19.05,73.66 21.41,71.3 43,71.3 43.18,71.12 | 48.26,71.12 48.26,45.72
  Bottom 0.61: 93.23,52.07 93.24,52.06 93.24,48.79 88.9,44.45 | T1.3 90.17,66.04 93.98,69.85 96.52,69.85 97.77,68.6 97.77,63.64 93.23,59.1 93.23,57.15 | ARD_NANO.9 25.4,49.53 J3.9 25.4,43.05 26.54,41.91 44.45,41.91 48.26,45.72
  Bottom 0.635: 93.23,57.15 93.23,52.07 | 88.9,44.45 85.09,40.64
N$24  (1 unrouted)
N$25
  Bottom 0.61: ARD_NANO.12 33.02,49.53 J3.12
N$26  (1 unrouted)
N$27  (1 unrouted)
N$28  (1 unrouted)
N$29
  Bottom 0.61: 55.77,76.2 55.77,72.28 BUZZER.-
  Bottom 0.635: T3.2 72.39,63.65 70.26,65.77 62.5,65.77 57.15,71.12 57.15,74.93 55.88,76.2 55.77,76.2
N$31  (1 unrouted)
N$32  (6 unrouted)
  Bottom 0.508: 86.36,46.99 85.97,47.38 85.97,62.62 85.09,63.5 | 77.47,69.17 77.47,69.85 72.39,74.93
  Bottom 0.61: ARD_NANO.6 17.78,49.53 J3.6
N$33  (1 unrouted)
  Bottom 0.508: ARD_NANO.29 6.35,63.5 11.43,58.42 31.75,58.42 33.02,59.69 36.83,59.69
  Bottom 0.61: ARD_NANO.29 J4.14
N$34
  Bottom 0.61: ARD_NANO.16 J4.1
N$35
  Bottom 0.61: ARD_NANO.17 J4.2
N$36
  Bottom 0.61: ARD_NANO.18 J4.3
N$37
  Bottom 0.508: AT/DATA.2 68.58,72.39 67.31,73.66 67.31,77.47 64.78,80 30.47,80 29.21,78.74 BT.1
N$38  (1 unrouted)
N$39  (1 unrouted)
  Bottom 0.61: ARD_NANO.20 J4.5
N$42  (1 unrouted)
N$43  (1 unrouted)
N$44  (1 unrouted)
N$45  (1 unrouted)
N$47  (1 unrouted)
N$48  (1 unrouted)
N$49  (1 unrouted)
RX  (1 unrouted)
  Bottom 0.61: ARD_NANO.26 J4.11
TX  (1 unrouted)
  Bottom 0.61: ARD_NANO.30 J4.15
VCC  (25 unrouted)
  Bottom 0.406: 96.52,59.69 97.79,60.96 97.71,61.04 97.69,61.04
  Bottom 0.61: 95.25,58.42 94.15,57.32 94.15,48.09 US_SR04.1
  Bottom 0.635: 55.88,68.58 6.35,68.58 AT/DATA.1 7.62,72.39

### Text on the board
tNames: Vcc | Gnd | D12 | D12 | IR2 | IR1 | Gnd | Reset | RX0 | TX1 | Gnd | Gnd | Gnd | Vcc | 4A | 4Y | Gnd | Gnd | 3Y | 3A | 3-4EN | vcc | D2 | 1-2EN | 1A | 1Y | Gnd | Gnd | 2Y | 2A | Vcc2 | Gnd | PINWHEEL ROBOTICS | D13 | D13 | D13 | D13 | 3VB | AREF | A0 | Echo | A7 | 5V | Reset | Gnd | Vin | Gnd | vcc | D3 | Gnd | Gnd | Vcc | Gnd | 9V | www.pinwheel.in | SCRATCH-BOT
bNames: SCRATCH-BOT | www.pinwheel.in